# Altium project SISTEM.PrjPcb
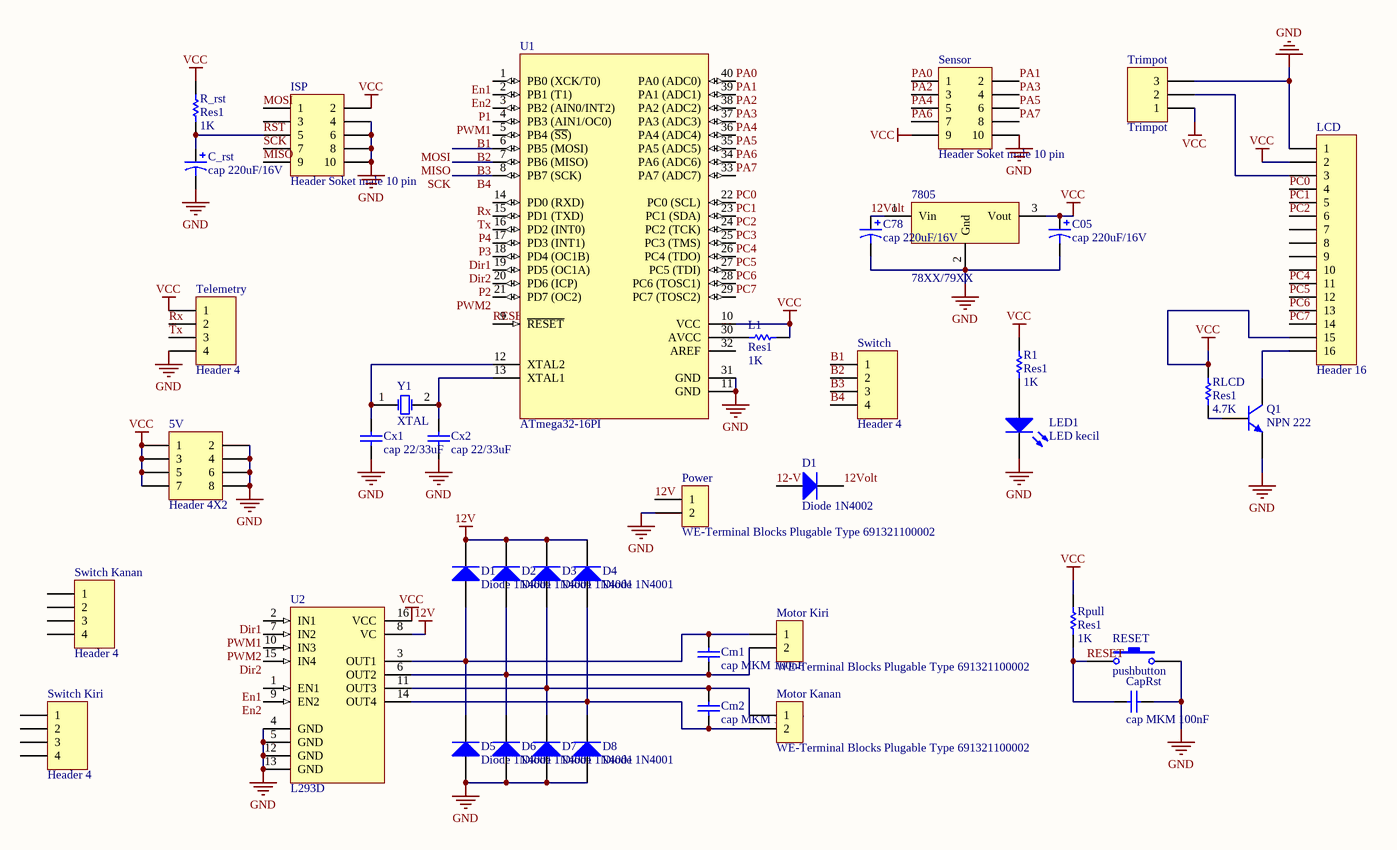
[diagram p0: SISTEM.SchDoc]
1 sheet, 41 parts. Net scope: global (net labels, ports and power ports of the same name join across sheets).
Board file: SISTEM.PcbDoc

## Sheet SISTEM.SchDoc
size A3

### Parts
(Parts that share a designator on the sheet are numbered #1, #2 ... from top to bottom, then left to right.)
5V  Header 4X2  [HDR2X4]
7805  78XX/79XX  [78XX/79XX]
C05  cap 220uF/16V  [cap 10uF/16V]
C78  cap 220uF/16V  [cap 10uF/16V]
C_rst  cap 220uF/16V  [cap 220uF/16V]
CapRst  cap MKM 100nF  [cap MKM 100nF diri]
Cm1  cap MKM 100nF  [cap MKM 100nF diri]
Cm2  cap MKM 100nF  [cap MKM 100nF diri]
Cx1  cap 22/33uF  [cap 22/33uF]
Cx2  cap 22/33uF  [cap 22/33uF]
D1#1  Diode 1N4002  [DIO10.46-5.3x2.8]
D1#2  Diode 1N4001  [DIO10.46-5.3x2.8]
D2  Diode 1N4001  [DIO10.46-5.3x2.8]
D3  Diode 1N4001  [DIO10.46-5.3x2.8]
D4  Diode 1N4001  [DIO10.46-5.3x2.8]
D5  Diode 1N4001  [DIO10.46-5.3x2.8]
D6  Diode 1N4001  [DIO10.46-5.3x2.8]
D7  Diode 1N4001  [DIO10.46-5.3x2.8]
D8  Diode 1N4001  [DIO10.46-5.3x2.8]
ISP  Header Soket male 10 pin  [Header Soket male 10 pin]
L1  Res1  value 1K  [AXIAL-0.3]
LCD  Header 16  [HDR1X16]
LED1  LED kecil  [LED kecil]
Motor_Kanan  WE-Terminal Blocks Plugable Type 691321100002  [691321100002]
Motor_Kiri  WE-Terminal Blocks Plugable Type 691321100002  [691321100002]
Power  WE-Terminal Blocks Plugable Type 691321100002  [691321100002]
Q1  NPN 222  [NPN (222)]
R1  Res1  value 1K  [AXIAL-0.3]
R_rst  Res1  value 1K  [AXIAL-0.3]
RESET  pushbutton  [pushbutton]
RLCD  Res1  value 4.7K  [AXIAL-0.3]
Rpull  Res1  value 1K  [AXIAL-0.3]
Sensor  Header Soket male 10 pin  [Header Soket male 10 pin]
Switch  Header 4  [HDR1X4]
Switch_Kanan  Header 4  [HDR1X4]
Switch_Kiri  Header 4  [HDR1X4]
Telemetry  Header 4  [HDR1X4]
Trimpot  Trimpot  [Trimpot Duduk]
U1  ATmega32-16PI  [40P6]
U2  L293D  [DIP16]
Y1  XTAL  [XTAL]

### Nets
12V: D1#2.2(K) D2.2(K) D3.2(K) D4.2(K) Power.1 U2.8(VC)
GND: 5V.2 5V.4 5V.6 5V.8 7805.2(Gnd) C05.2 C78.2 C_rst.2 CapRst.2 Cx1.1 Cx2.1 D5.1(A) D6.1(A) D7.1(A) D8.1(A) ISP.4 ISP.6 ISP.8 ISP.10 LCD.1 LED1.2(K) Power.2 Q1.1(E) RESET.2 Sensor.10 Telemetry.4 Trimpot.3 U1.11(GND) U1.31(GND) U2.4(GND) U2.5(GND) U2.12(GND) U2.13(GND)
VCC: 5V.1 5V.3 5V.5 5V.7 7805.3(Vout) C05.1 ISP.2 L1.2 LCD.2 LCD.15 R1.2 R_rst.2 RLCD.2 Rpull.2 Sensor.9 Telemetry.1 Trimpot.1 U1.10(VCC) U2.16(VCC)
12-V: D1#1.1(A)
12Volt: 7805.1(Vin) C78.1 D1#1.2(K)
B1: Switch.1 U1.5(PB4_(~{SS}))
B2: ISP.1 Switch.2 U1.6(PB5_(MOSI))  [also labelled MOSI]
B3: ISP.9 Switch.3 U1.7(PB6_(MISO))  [also labelled MISO]
B4: ISP.7 Switch.4 U1.8(PB7_(SCK))  [also labelled SCK]
Dir1: U1.18(PD4_(OC1B)) U2.2(IN1)
Dir2: U1.19(PD5_(OC1A)) U2.15(IN4)
En1: U1.1(PB0_(XCK/T0)) U2.1(EN1)
En2: U1.2(PB1_(T1)) U2.9(EN2)
P1: U1.3(PB2_(AIN0/INT2))
P2: U1.20(PD6_(ICP))
P3: U1.17(PD3_(INT1))
P4: U1.16(PD2_(INT0))
PA0: Sensor.1 U1.40(PA0_(ADC0))
PA1: Sensor.2 U1.39(PA1_(ADC1))
PA2: Sensor.3 U1.38(PA2_(ADC2))
PA3: Sensor.4 U1.37(PA3_(ADC3))
PA4: Sensor.5 U1.36(PA4_(ADC4))
PA5: Sensor.6 U1.35(PA5_(ADC5))
PA6: Sensor.7 U1.34(PA6_(ADC6))
PA7: Sensor.8 U1.33(PA7_(ADC7))
PC0: LCD.4 U1.22(PC0_(SCL))
PC1: LCD.5 U1.23(PC1_(SDA))
PC2: LCD.6 U1.24(PC2_(TCK))
PC3: U1.25(PC3_(TMS))
PC4: LCD.11 U1.26(PC4_(TDO))
PC5: LCD.12 U1.27(PC5_(TDI))
PC6: LCD.13 U1.28(PC6_(TOSC1))
PC7: LCD.14 U1.29(PC7_(TOSC2))
PWM1: U1.4(PB3_(AIN1/OC0)) U2.7(IN2)
PWM2: U1.21(PD7_(OC2)) U2.10(IN3)
RESET: CapRst.1 RESET.1 Rpull.1 U1.9(~{RESET})
RST: C_rst.1 ISP.5 R_rst.1
Rx: Telemetry.2 U1.14(PD0_(RXD))
Tx: Telemetry.3 U1.15(PD1_(TXD))
NetCm1_1: Cm1.1 D2.1(A) D6.2(K) Motor_Kiri.2 U2.6(OUT2)
NetCm1_2: Cm1.2 D1#2.1(A) D5.2(K) Motor_Kiri.1 U2.3(OUT1)
NetCm2_1: Cm2.1 D4.1(A) D8.2(K) Motor_Kanan.2 U2.14(OUT4)
NetCm2_2: Cm2.2 D3.1(A) D7.2(K) Motor_Kanan.1 U2.11(OUT3)
NetCx1_2: Cx1.2 U1.12(XTAL2) Y1.1(OSC1)
NetCx2_2: Cx2.2 U1.13(XTAL1) Y1.2(OSC2)
NetL1_1: L1.1 U1.30(AVCC)
NetLCD_3: LCD.3 Trimpot.2
NetLCD_16: LCD.16 Q1.3(C)
NetLED1_1: LED1.1(A) R1.1
NetQ1_2: Q1.2(B) RLCD.1

Not connected (* = marked no-connect by the designer): ISP 3; LCD 7 8 9 10; Switch_Kanan 1 2 3 4; Switch_Kiri 1 2 3 4; U1 32(AREF)

### Notes on the sheet
- Title
- Size:
- Date:
- A3
- Number:
- Time:
- Revision:
- Sheet
- of
- File:

### Library data of the parts
5V = Header 4X2: Header, 4-Pin, Dual row; LatestRevisionDate: 17-Jul-2002; LatestRevisionNote: Re-released for DXP Platform.; Publisher: Altium Limited
7805 = 7805/7809/7812/7905/7909/7912
C05 C78 = cap 10uF/16V
D1#1 = Diode 1N4002: 1 Amp General Purpose Rectifier; Published: 8-Jun-2000; LatestRevisionDate: 17-Jul-2002; LatestRevisionNote: Re-released for DXP Platform.; DatasheetVersion: 1998; PackageVersion: Aug-1999; PackageReference: DO-41; Publisher: Altium Limited; Code_JEDEC: DO-204-AL; ComponentLink1Description: Manufacturer Link; ComponentLink1URL: http://www.fairchildsemi.com/; ComponentLink2Description: Datasheet; ComponentLink2URL: http://www.fairchildsemi.com/ds/1N%2F1N4001.pdf
D1#2 D2-D8 = Diode 1N4001: 1 Amp General Purpose Rectifier; Published: 8-Jun-2000; LatestRevisionDate: 17-Jul-2002; LatestRevisionNote: Re-released for DXP Platform.; DatasheetVersion: 1998; PackageVersion: Aug-1999; PackageReference: DO-41; Publisher: Altium Limited; Code_JEDEC: DO-204-AL; ComponentLink1Description: Manufacturer Link; ComponentLink1URL: http://www.fairchildsemi.com/; ComponentLink2Description: Datasheet; ComponentLink2URL: http://www.fairchildsemi.com/ds/1N%2F1N4001.pdf
L1 R1 R_rst RLCD Rpull = Res1: Resistor; Published: 8-Jun-2000; LatestRevisionDate: 17-Jul-2002; LatestRevisionNote: Re-released for DXP Platform.; PackageReference: AXIAL-0.3; Publisher: Altium Limited
  L1: PackageDescription: Axial Device, Thru-Hole; 2 Leads; 0.3 in Pin Spacing
LCD = Header 16: Header, 16-Pin; LatestRevisionDate: 17-Jul-2002; LatestRevisionNote: Re-released for DXP Platform.; Publisher: Altium Limited
Motor_Kanan Motor_Kiri Power = WE-Terminal Blocks Plugable Type 691321100002: WR-TBL Terminal block - serie 3211 - 3.50 mm; Manufacturer: W¨¹rth Elektronik eiSos GmbH; ComponentLink1 Description: Manufacturer; ComponentLink2 Description: Datasheet; NoPins: 2; Created Date: 9 December 2013; partNo: 691321100002; ComponentLink1URL: http://www.we-online.com; ComponentLink2URL: http://katalog.we-online.de/em/datasheet/6913211000xx.pdf; Created by: Karrer Zheng
Q1 = NPN (222)
Switch Switch_Kanan Switch_Kiri Telemetry = Header 4: Header, 4-Pin; LatestRevisionDate: 17-Jul-2002; LatestRevisionNote: Re-released for DXP Platform.; Publisher: Altium Limited
Trimpot = Trimpot Duduk
U1 = ATmega32-16PI: 8-Bit AVR Microcontroller with 32K Bytes of In-System Programmable Flash Memory; Published: 17-Sep-2003; DatasheetVersion: 2503C-AVR-10/02; PackageVersion: revB, Sep-2001; PackageReference: 40P6; Publisher: Altium Limited; PackageDescription: 40-lead (0.600"/15.24mm Wide) Plastic Dual Inline Package (PDIP); Supplier 1: Digi-Key; Supplier Part Number 1: ATMEGA32-16PI-ND; Supplier 2: Farnell; Supplier Part Number 2: 4376328; Supplier 3: Mouser; Supplier Part Number 3: 556-ATMEGA32-16PI; Code_JEDEC: MS-011-AC; ComponentLink1Description: Datasheet; ComponentLink1URL: http://www.atmel.com/dyn/resources/prod_documents/doc2503.pdf; ComponentLink2Description: Atmel.com Home; ComponentLink2URL: http://www.atmel.com
U2 = L293D: Push-Pull Four Channel Driver With Diode; Published: 8-Jun-2000; LatestRevisionDate: 06-Jun-2005; LatestRevisionNote: Stylized 3D Model Added.; DatasheetVersion: Jun-1996; PackageVersion: Apr-1996; PackageReference: DIP16; Publisher: Altium Limited; PackageDescription: DIP; 16 Leads; Row Spacing 7.62 mm; Pitch 2.54 mm; ComponentLink1Description: Manufacturer Link; ComponentLink1URL: http://www.st.com/; ComponentLink2Description: Datasheet; ComponentLink2URL: http://www.st.com/stonline/products/literature/ds/1330/l293d.pdf